# EAGLE schematic LEDSlave 1 (EAGLE 7.6.0)
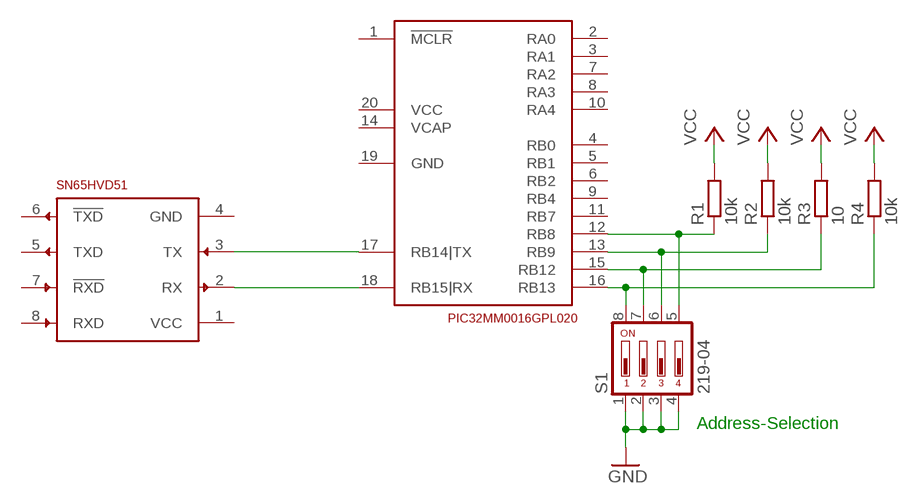
[diagram p0: schematic, sheet 1]

## Parts
R1  10k  R-EU_R0805  [R0805]
R2  10k  R-EU_R0805  [R0805]
R3  10  R-EU_R0805  [R0805]
R4  10k  R-EU_R0805  [R0805]
S1  219-04  [CTS-219-04]
U$1  PIC32MM0016GPL020  [SSOP20]
U$2  SN65HVD51  [SO-08]

## Nets
GND: S1.1 S1.2 S1.3 S1.4
N$1: U$1.17(RB14|TX) U$2.3(TX)
N$2: U$1.18(RB15|RX) U$2.2(RX)
N$3: R4.1 S1.8 U$1.16(RB13)
N$4: R3.1 S1.7 U$1.15(RB12)
N$5: R2.1 S1.6 U$1.13(RB9)
N$6: R1.1 S1.5 U$1.12(RB8)
VCC: R1.2 R2.2 R3.2 R4.2
Unconnected: U$1.1(!MCLR) U$1.2(RA0) U$1.3(RA1) U$1.4(RB0) U$1.5(RB1) U$1.6(RB2) U$1.7(RA2) U$1.8(RA3) U$1.9(RB4) U$1.10(RA4) U$1.11(RB7) U$1.14(VCAP) U$1.19(GND) U$1.20(VCC) U$2.1(VCC) U$2.4(GND) U$2.5(TXD) U$2.6(!TXD) U$2.7(!RXD) U$2.8(RXD)

## Notes on the sheet
- Address-Selection

## Library data of the parts
R1-R4 = rcl:R-EU_: RESISTOR, European symbol
S1 = switch-dil:219-04*: Surface Mount DIP Switch Series 219 SMT CTS Electronic Components Sourc: www.ctscorp.com; OC_FARNELL: unknown; OC_NEWARK: unknown
U$1 = PIC32MM0016GPL020:PIC32MM0016GPL020
U$2 = SN65HVD51 1:SN65HVD51